# EAGLE schematic Honey_v2_a (EAGLE 7.2.0)
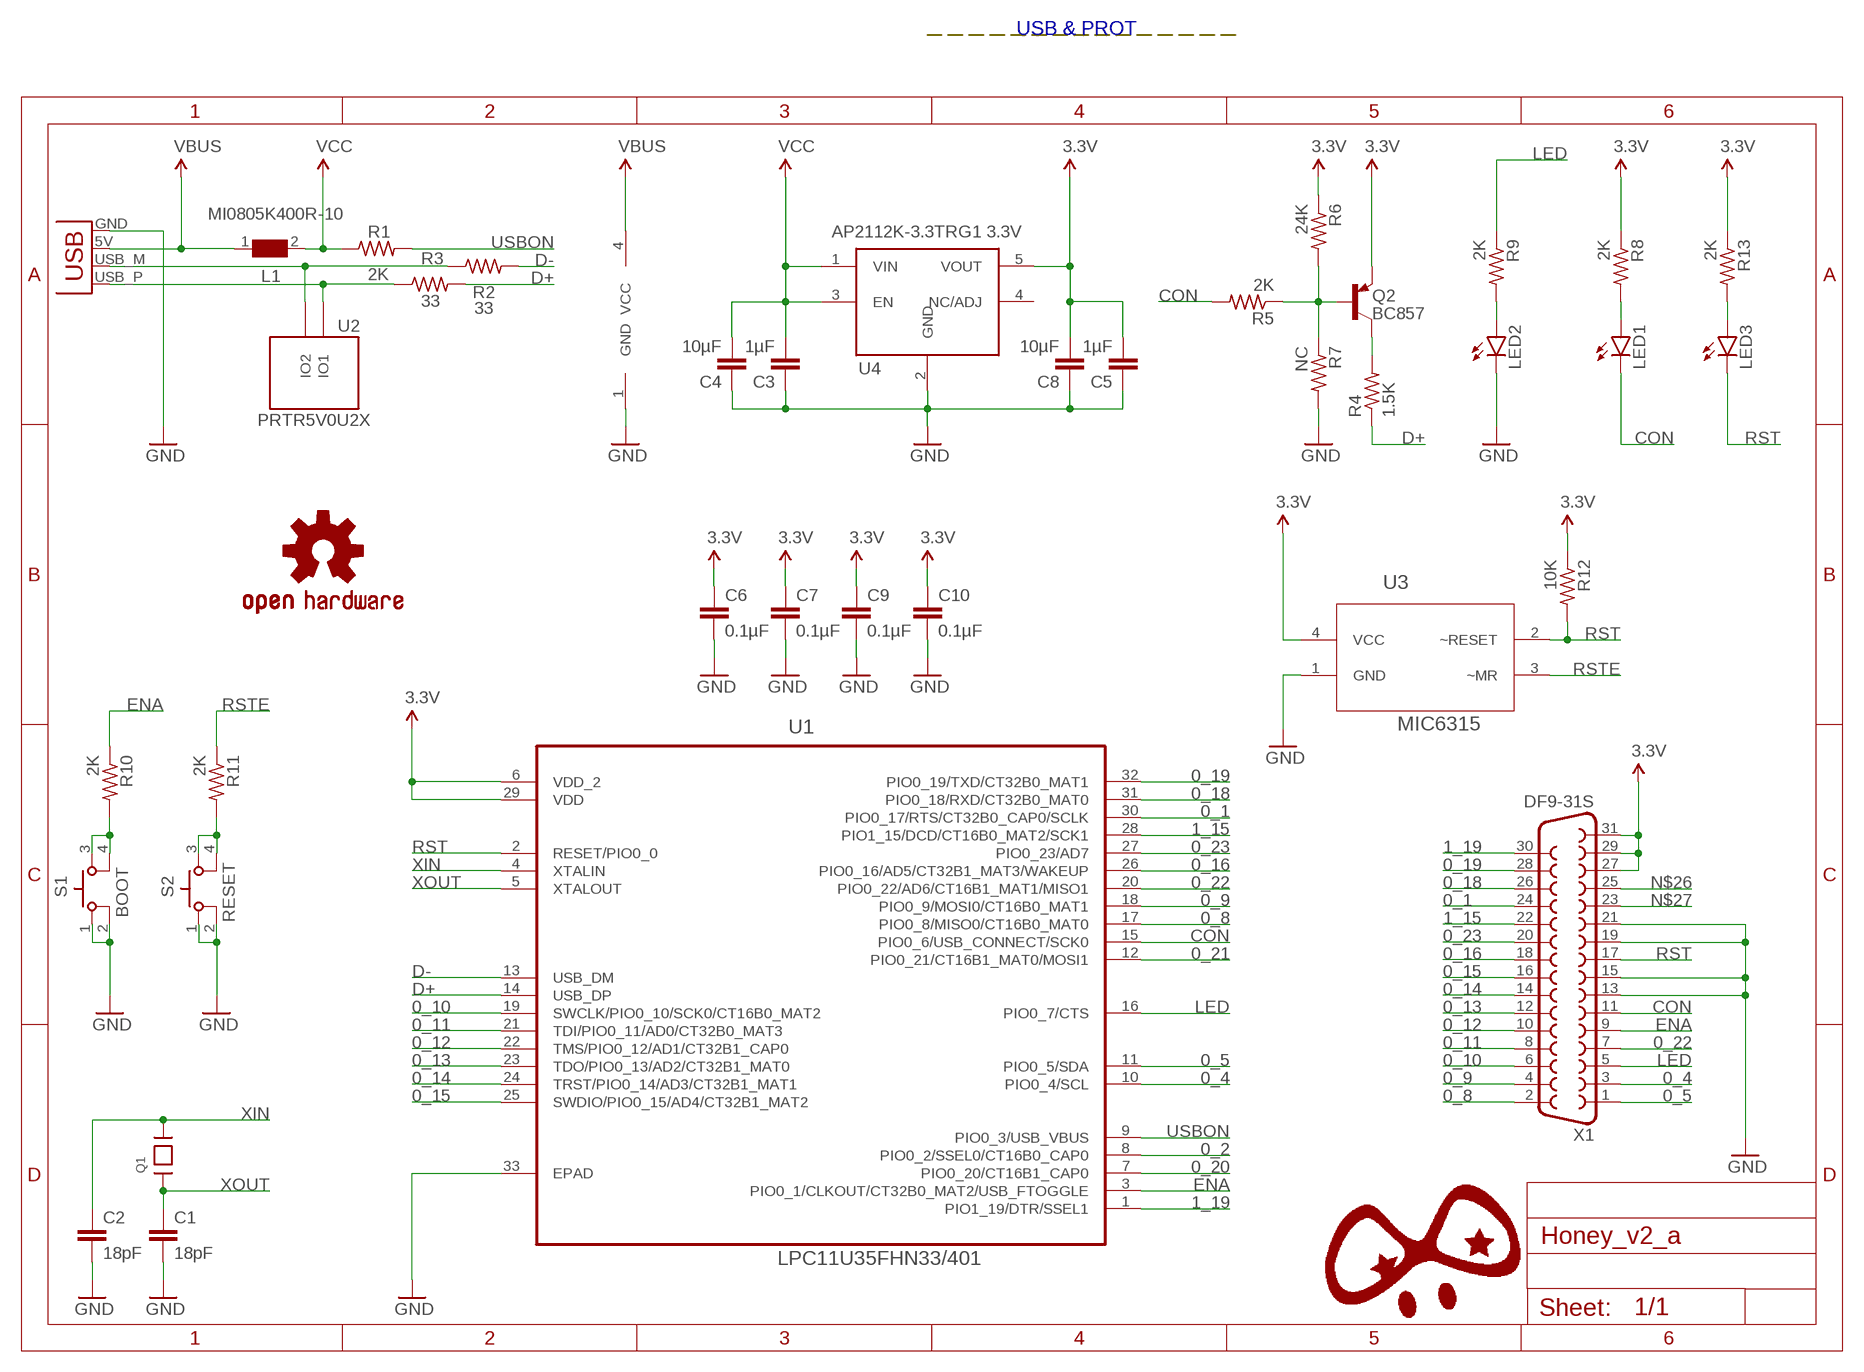
[diagram p0: schematic, sheet 1]

## Parts
C1  18pF  C-EUC0402  [C0402]
C2  18pF  C-EUC0402  [C0402]
C3  1µF  CAP0603-CAP  [0603-CAP]
C4  10µF  CAP0603-CAP  [0603-CAP]
C5  1µF  CAP0603-CAP  [0603-CAP]
C6  0.1µF  C-EUC0402  [C0402]
C7  0.1µF  C-EUC0402  [C0402]
C8  10µF  CAP0603-CAP  [0603-CAP]
C9  0.1µF  C-EUC0402  [C0402]
C10  0.1µF  C-EUC0402  [C0402]
J1  USBPCB  [USB-A-PCB]
L1  MI0805K400R-10  FERRITE-74279201_0805  [0805]
LED1  LED0603  [LED-0603]
LED2  LED0603  [LED-0603]
LED3  LED0603  [LED-0603]
LOGO1  OSHW-LOGOS  [OSHW-LOGO-S]
Q1  12MHz 4 pad crystal 3.2x2.5  CRYSTAL3.2X2.5  [CRYSTAL_3.2X2.5]
Q2  BC857  BC857A-PNP-SOT23-BEC  [SOT23-BEC]
R1  2K  R-US_R0402  [R0402]
R2  33  R-US_R0603  [R0603]
R3  33  R-US_R0603  [R0603]
R4  1.5K  R-US_R0402  [R0402]
R5  2K  R-US_R0402  [R0402]
R6  24K  R-US_R0402  [R0402]
R7  NC  R-US_R0402  [R0402]
R8  2K  R-US_R0402  [R0402]
R9  2K  R-US_R0402  [R0402]
R10  2K  R-US_R0402  [R0402]
R11  2K  R-US_R0402  [R0402]
R12  10K  R-US_R0402  [R0402]
R13  2K  R-US_R0402  [R0402]
S1  BOOT  MINI_PUSHBUTTON  [MINI_PUSHBUTTON]
S2  RESET  MINI_PUSHBUTTON  [MINI_PUSHBUTTON]
U1  LPC11U35FHN33/401  [QFN65P700X700X100-33N]
U2  PRTR5V0U2X  [SOT-143B]
U3  MIC6315  [SOT-143B]
U4  AP2112K-3.3TRG1 3.3V  5PIN_REG  [SOT23-5]
X1  DF9-31S  [DF9-31S]

## Nets
0_1: U1.30(PIO0_17/RTS/CT32B0_CAP0/SCLK) X1.24
0_2: U1.8(PIO0_2/SSEL0/CT16B0_CAP0)
0_4: U1.10(PIO0_4/SCL) X1.3
0_5: U1.11(PIO0_5/SDA) X1.1
0_8: U1.17(PIO0_8/MISO0/CT16B0_MAT0) X1.2
0_9: U1.18(PIO0_9/MOSI0/CT16B0_MAT1) X1.4
0_10: U1.19(SWCLK/PIO0_10/SCK0/CT16B0_MAT2) X1.6
0_11: U1.21(TDI/PIO0_11/AD0/CT32B0_MAT3) X1.8
0_12: U1.22(TMS/PIO0_12/AD1/CT32B1_CAP0) X1.10
0_13: U1.23(TDO/PIO0_13/AD2/CT32B1_MAT0) X1.12
0_14: U1.24(TRST/PIO0_14/AD3/CT32B1_MAT1) X1.14
0_15: U1.25(SWDIO/PIO0_15/AD4/CT32B1_MAT2) X1.16
0_16: U1.26(PIO0_16/AD5/CT32B1_MAT3/WAKEUP) X1.18
0_18: U1.31(PIO0_18/RXD/CT32B0_MAT0) X1.26
0_19: U1.32(PIO0_19/TXD/CT32B0_MAT1) X1.28
0_20: U1.7(PIO0_20/CT16B1_CAP0)
0_21: U1.12(PIO0_21/CT16B1_MAT0/MOSI1)
0_22: U1.20(PIO0_22/AD6/CT16B1_MAT1/MISO1) X1.7
0_23: U1.27(PIO0_23/AD7) X1.20
1_15: U1.28(PIO1_15/DCD/CT16B0_MAT2/SCK1) X1.22
1_19: U1.1(PIO1_19/DTR/SSEL1) X1.30
3.3V: C5.2 C6.1 C7.1 C8.2 C9.1 C10.1 Q2.E R6.1 R8.1 R12.1 R13.1 U1.6(VDD_2) U1.29(VDD) U3.4(VCC) U4.5(VOUT) X1.27 X1.29 X1.31
AD+: J1.USB_P(D+) R3.1 U2.2(IO1)
AD-: J1.USB_M(D-) R2.1 U2.3(IO2)
CON: LED1.C R5.2 U1.15(PIO0_6/USB_CONNECT/SCK0) X1.11
D+: R3.2 R4.1 U1.14(USB_DP)
D-: R2.2 U1.13(USB_DM)
ENA: R10.1 U1.3(PIO0_1/CLKOUT/CT32B0_MAT2/USB_FTOGGLE) X1.9
GND: C1.2 C2.2 C3.1 C4.1 C5.1 C6.2 C7.2 C8.1 C9.2 C10.2 J1.GND LED2.C R7.2 S1.1 S1.2 S2.1 S2.2 U1.33(EPAD) U2.1(GND) U3.1(GND) U4.2(GND) X1.13 X1.15 X1.19 X1.21
LED: R9.1 U1.16(PIO0_7/CTS) X1.5
N$1: Q2.C R4.2
N$2: Q2.B R5.1 R6.2 R7.1
N$12: LED2.A R9.2
N$14: R10.2 S1.3 S1.4
N$20: R11.2 S2.3 S2.4
N$22: LED1.A R8.2
N$23: LED3.A R13.2
N$26: X1.25
N$27: X1.23
RST: LED3.C R12.2 U1.2(RESET/PIO0_0) U3.2(~RESET) X1.17
RSTE: R11.1 U3.3(~MR)
USBON: R1.2 U1.9(PIO0_3/USB_VBUS)
VBUS: J1.5V(VBUS) L1.1 U2.4(VCC)
VCC: C3.2 C4.2 L1.2 R1.1 U4.1(VIN) U4.3(EN)
XIN: C2.1 Q1.3 U1.4(XTALIN)
XOUT: C1.1 Q1.1 U1.5(XTALOUT)
Unconnected: U4.4(NC/ADJ)

## Notes on the sheet
- USB & PROT

## Library data of the parts
C1 C2 C6 C7 C9 C10 = resistor:C-EU: CAPACITOR, European symbol
C3-C5 C8 = SparkFun-Passives:CAP: Capacitor Standard 0603 ceramic capacitor, and 0.1" leaded capacitor.
J1 = SparkFun-Connectors:USB: USB Connectors USB-B-PTH is fully proven SKU : PRT-00139/CONN-08278 USB-miniB is fully proven SKU : PRT-00587 USB-A-PCB is untested. USB-A-H is throughly reviewed, but untested. Spark Fun Electronics SKU : PRT-00437 USB-B-SMT is throughly reviewed, but untested. Needs silkscreen touching up. USB-A-S has not been used/tested USB-MB-H has not been used/tested USB-MICROB has been used. CONN-09505
L1 = Honey_v2:FERRITE: SMD EMI Suppression Ferrite Beads; MPN: 74279201; OC_FARNELL: 1635708; OC_NEWARK: 08P2359; PACKAGE: IND-0805; SUPPLIER: Wuerth Elektronik
LED1-LED3 = SparkFun-LED:LED: LEDs Standard schematic elements and footprints for 5mm, 3mm, 1206, and 0603 sized LEDs. 5mm - Spark Fun Electronics SKU : COM-00529 (and others)
LOGO1 = SparkFun-Aesthetics:OSHW-LOGO: Open Source Hardware Logo This logo indicates the piece of hardware it is found on incorporates a OSHW license and/or adheres to the definition of open source hardware found here: http://freedomdefined.org/OSHW
Q1 = GHI:CRYSTAL3.2X2.5
Q2 = transistor:*-PNP-: PNP Transistror
R1-R13 = resistor:R-US_: RESISTOR, American symbol
S1 S2 = GHI2:MINI_PUSHBUTTON
U1 = Honey_v2:LPC11U35FHN33/401: MCU, 32BIT, ARM CORTEX-M0, 32HVQFN; MPN: LPC11U35FHN33/401; OC_FARNELL: 2115659; OC_NEWARK: 24W5343; PACKAGE: HVQFN33; SUPPLIER: NXP
U2 = Honey_v2:PRTR5V0U2X?: I2C-Bus EDS Protection Ulta low capacitance double rail-to-rail ESD protection diode Documentation Datasheet <http://www.nxp.com/documents/data_sheet/PRTR5V0U2X.pdf> General Description Ultra low capacitance rail-to-rail ElectroStatic Discharge (ESD) protection diode in a small SOT143B Surface-Mounted Device (SMD) plastic package designed to protect two Hi-Speed data lines or high-frequency signal lines from the damage caused by ESD and other transients. PRTR5V0U2X incorporates two pairs of ultra low capacitance rail-to-rail diodes as well as an additional ESD protection diode to ensure signal line protection even if no supply voltage is available. Features ESD protection of two Hi-Speed data lines or high-frequency signal lines Ultra low input/output to ground capacitance: C(I/O-GND) = 1 pF ESD protection up to 8kV IEC 61000-4-2, level 4 (ESD) Very low clamping voltage due to an integrated additional ESD protection diode Very low reverse current Small SMD plastic package Applications USB 2.0 ports Digital Video Interface (DVI)/High Definition Multimedia Interface (HDMI) interfaces Mobile and cordless phones Personal Digital Assistants (PDA) Digital Cameras Wide Area Network (WAN) / Local Area Network (LAN) systems PCs, notebooks, printers, and other PC peripherals; APPLICATIONS: General Purpose; BIDIRECTIONAL_CHANNELS: 2; CAPACITANCE: 1pF @ 1MHz; CURRENT_PEAK_PULSE: -; DESCRIPTION: TVS DIODE 5.5VWM SOT143B; DOCUMENTATION_LINK: <a href="http://www.nxp.com/documents/data_sheet/PRTR5V0U2X.pdf">Datasheet</a>; DOCUMENTATION_URL: http://www.nxp.com/documents/data_sheet/PRTR5V0U2X.pdf; MANUFACTURER: NXP Semiconductors; MOUNTING_TYPE: Surface Mount; OPERATING_TEMPERATURE: -40C ~ 85C; PART_NUMBER: PRTR5V0U2X,215; POWER-PEAK_PULSE: -; POWER_LINE_PROTECTION: Yes; SUPPLIER_ITEM_LINK: <a href="http://www.digikey.com/product-detail/en/PRTR5V0U2X,215/568-4140-1-ND/1589981">Details</a>; SUPPLIER_ITEM_NUMBER: 568-4140-1-ND; SUPPLIER_ITEM_URL: http://www.digikey.com/product-detail/en/PRTR5V0U2X,215/568-4140-1-ND/1589981; SUPPLIER_LINK: <a href="http://www.digikey.com">Home Page</a>; SUPPLIER_NAME: Digi-Key; SUPPLIER_URL: http://www.digikey.com; TYPE: Steering (Rail to Rail); UNIDIRECTIONAL_CHANNELS: -; VOLTAGE_BREAKDOWN: 6V; VOLTAGE_CLAMPING: -; VOLTAGE_REVERSE: 5.5V
U3 = Honey_v2:MIC6315: MIC6315
U4 = GHI:5PIN_REG
X1 = con-hirose:DF9-31S: SMD CONNECTOR Source: con-hirose.lbr from Bob Starr <rtzaudio@mindspring.com>; MPN: DF9-31S-1V(32); OC_FARNELL: 1798382; OC_NEWARK: 74R3383

## Net classes
0 default: width 0.254 mm, drill 0.254 mm, clearance 0.203 mm